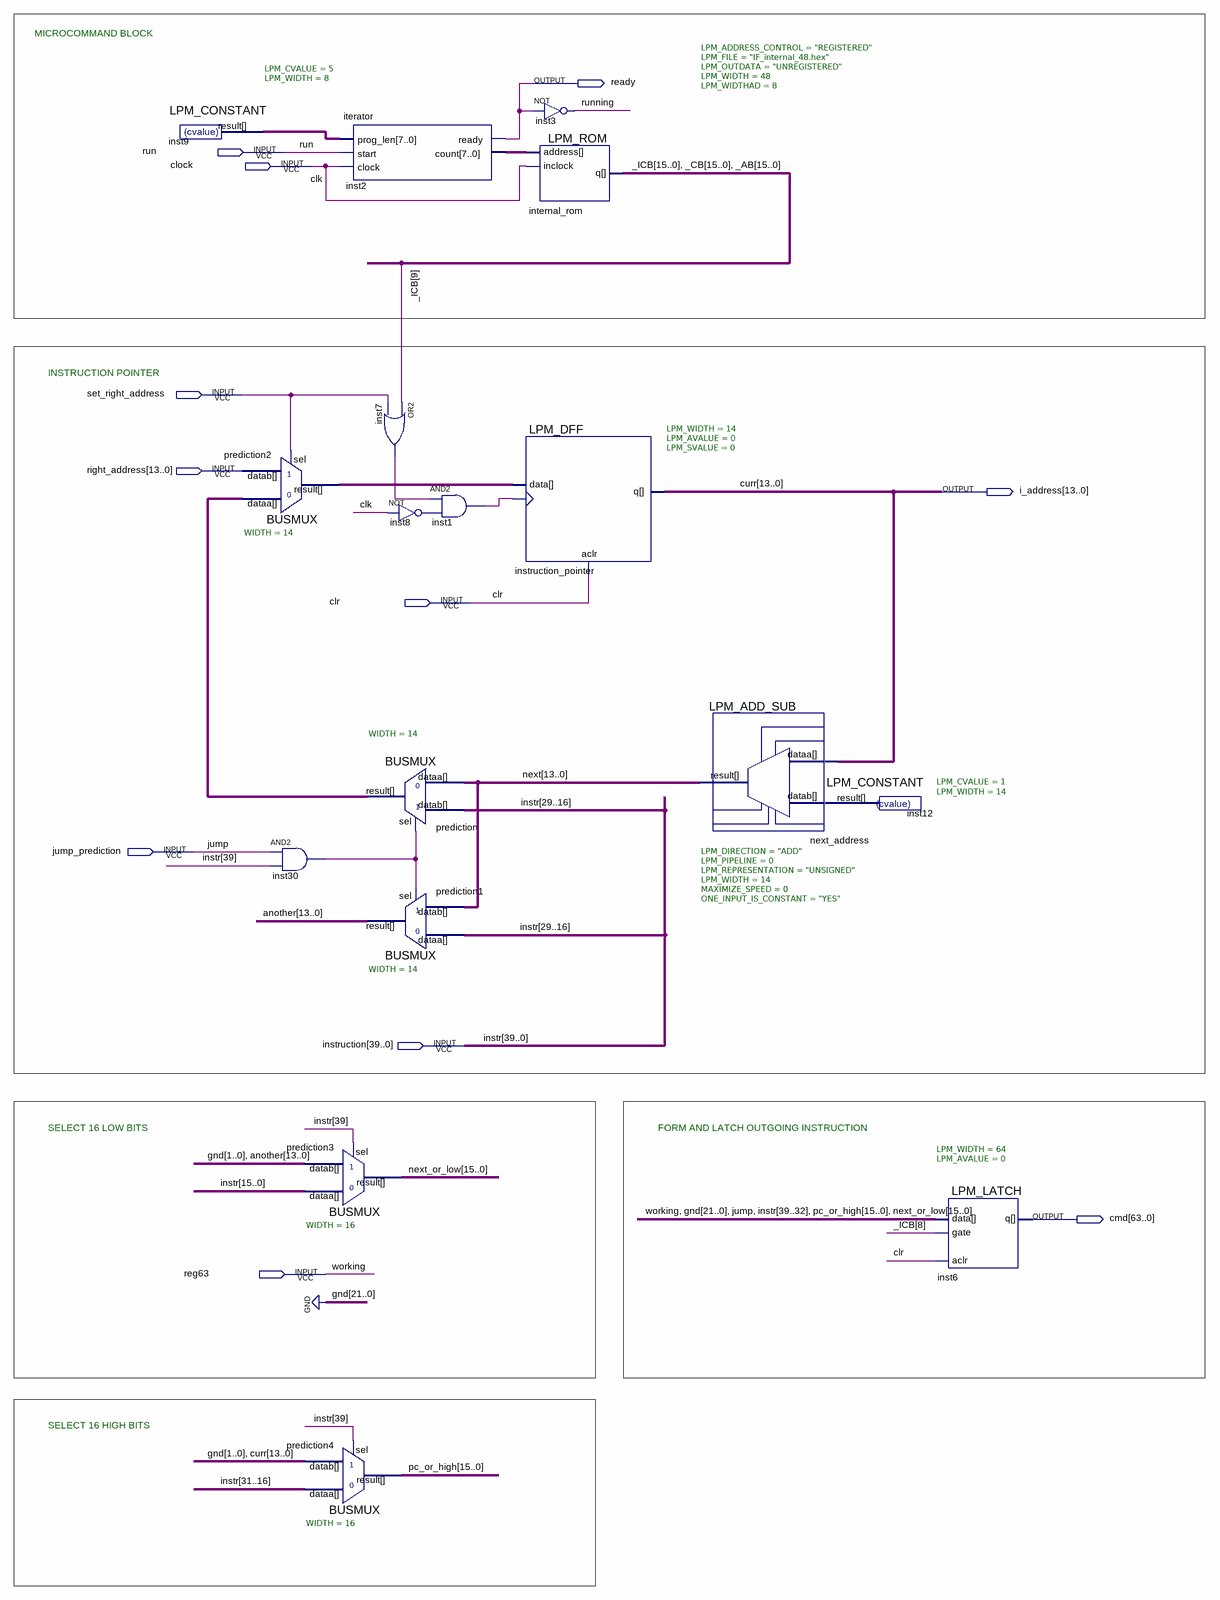
[diagram p0: schematic sheet]
// Quartus schematic IF.bdf as structural Verilog: 17 symbols, 11 pins
module IF (
  input  run,
  input  clock,
  input  set_right_address,
  input  [13:0] right_address,
  input  clr,
  input  jump_prediction,
  input  [39:0] instruction,
  input  reg63,
  output ready,
  output [13:0] i_address,
  output [63:0] cmd
);

  wire inst1_out, inst7_out, inst8_out, inst30_out, running;
  wire [7:0] inst2_count, inst9_result;
  wire [13:0] another, inst12_result, next, prediction2_result, prediction_result;
  wire [15:0] _AB, _CB, _ICB, next_or_low, pc_or_high;

  LPM_CONSTANT #(.LPM_CVALUE(5), .LPM_WIDTH(8)) inst9 (.result(inst9_result));
  BUSMUX #(.WIDTH(14)) prediction2 (
    .datab(right_address), .sel(set_right_address), .dataa(prediction_result), .result(prediction2_result));
  and inst30 (inst30_out, jump_prediction, instruction[39]);
  BUSMUX #(.WIDTH(16)) prediction3 (
    .datab({2'b00, another}), .sel(instruction[39]), .dataa(instruction[15:0]), .result(next_or_low));
  BUSMUX #(.WIDTH(16)) prediction4 (
    .datab({2'b00, i_address}), .sel(instruction[39]), .dataa(instruction[31:16]), .result(pc_or_high));
  iterator inst2 (.prog_len(inst9_result), .start(run), .clock(clock), .ready(ready), .count(inst2_count));
  or inst7 (inst7_out, _ICB[9], set_right_address);
  not inst8 (inst8_out, clock);
  BUSMUX #(.WIDTH(14)) prediction (
    .datab(instruction[29:16]), .sel(inst30_out), .dataa(next), .result(prediction_result));
  BUSMUX #(.WIDTH(14)) prediction1 (.datab(next), .sel(inst30_out), .dataa(instruction[29:16]), .result(another));
  and inst1 (inst1_out, inst7_out, inst8_out);
  not inst3 (running, ready);
  LPM_ROM #(.LPM_ADDRESS_CONTROL("REGISTERED"), .LPM_FILE("IF_internal_48.hex"), .LPM_OUTDATA("UNREGISTERED"), .LPM_WIDTH(48), .LPM_WIDTHAD(8)) internal_rom (
    .address(inst2_count), .inclock(clock), .q({_ICB, _CB, _AB}));
  LPM_DFF #(.LPM_WIDTH(14), .LPM_AVALUE(0), .LPM_SVALUE(0)) instruction_pointer (
    .clock(inst1_out), .data(prediction2_result), .aclr(clr), .q(i_address));
  LPM_ADD_SUB #(.LPM_DIRECTION("ADD"), .LPM_PIPELINE(0), .LPM_REPRESENTATION("UNSIGNED"), .LPM_WIDTH(14), .MAXIMIZE_SPEED(0), .ONE_INPUT_IS_CONSTANT("YES")) next_address (
    .datab(inst12_result), .dataa(i_address), .result(next));
  LPM_CONSTANT #(.LPM_CVALUE(1), .LPM_WIDTH(14)) inst12 (.result(inst12_result));
  LPM_LATCH #(.LPM_WIDTH(64), .LPM_AVALUE(0)) inst6 (
    .aclr(clr), .data({reg63, {22{1'b0}}, jump_prediction, instruction[39:32], pc_or_high, next_or_low}),
    .gate(_ICB[8]), .q(cmd));

  // Other names for the same wires on the sheet: clk = clock; curr[13:0] = i_address; instr[39:0] = instruction;
  //   jump = jump_prediction; working = reg63

  // Notes on the sheet:
  //   MICROCOMMAND BLOCK
  //   INSTRUCTION POINTER
  //   SELECT 16 LOW BITS
  //   FORM AND LATCH OUTGOING INSTRUCTION
  //   SELECT 16 HIGH BITS
endmodule
